# EAGLE design RectifierPartTwo (EAGLE 9.6.2)
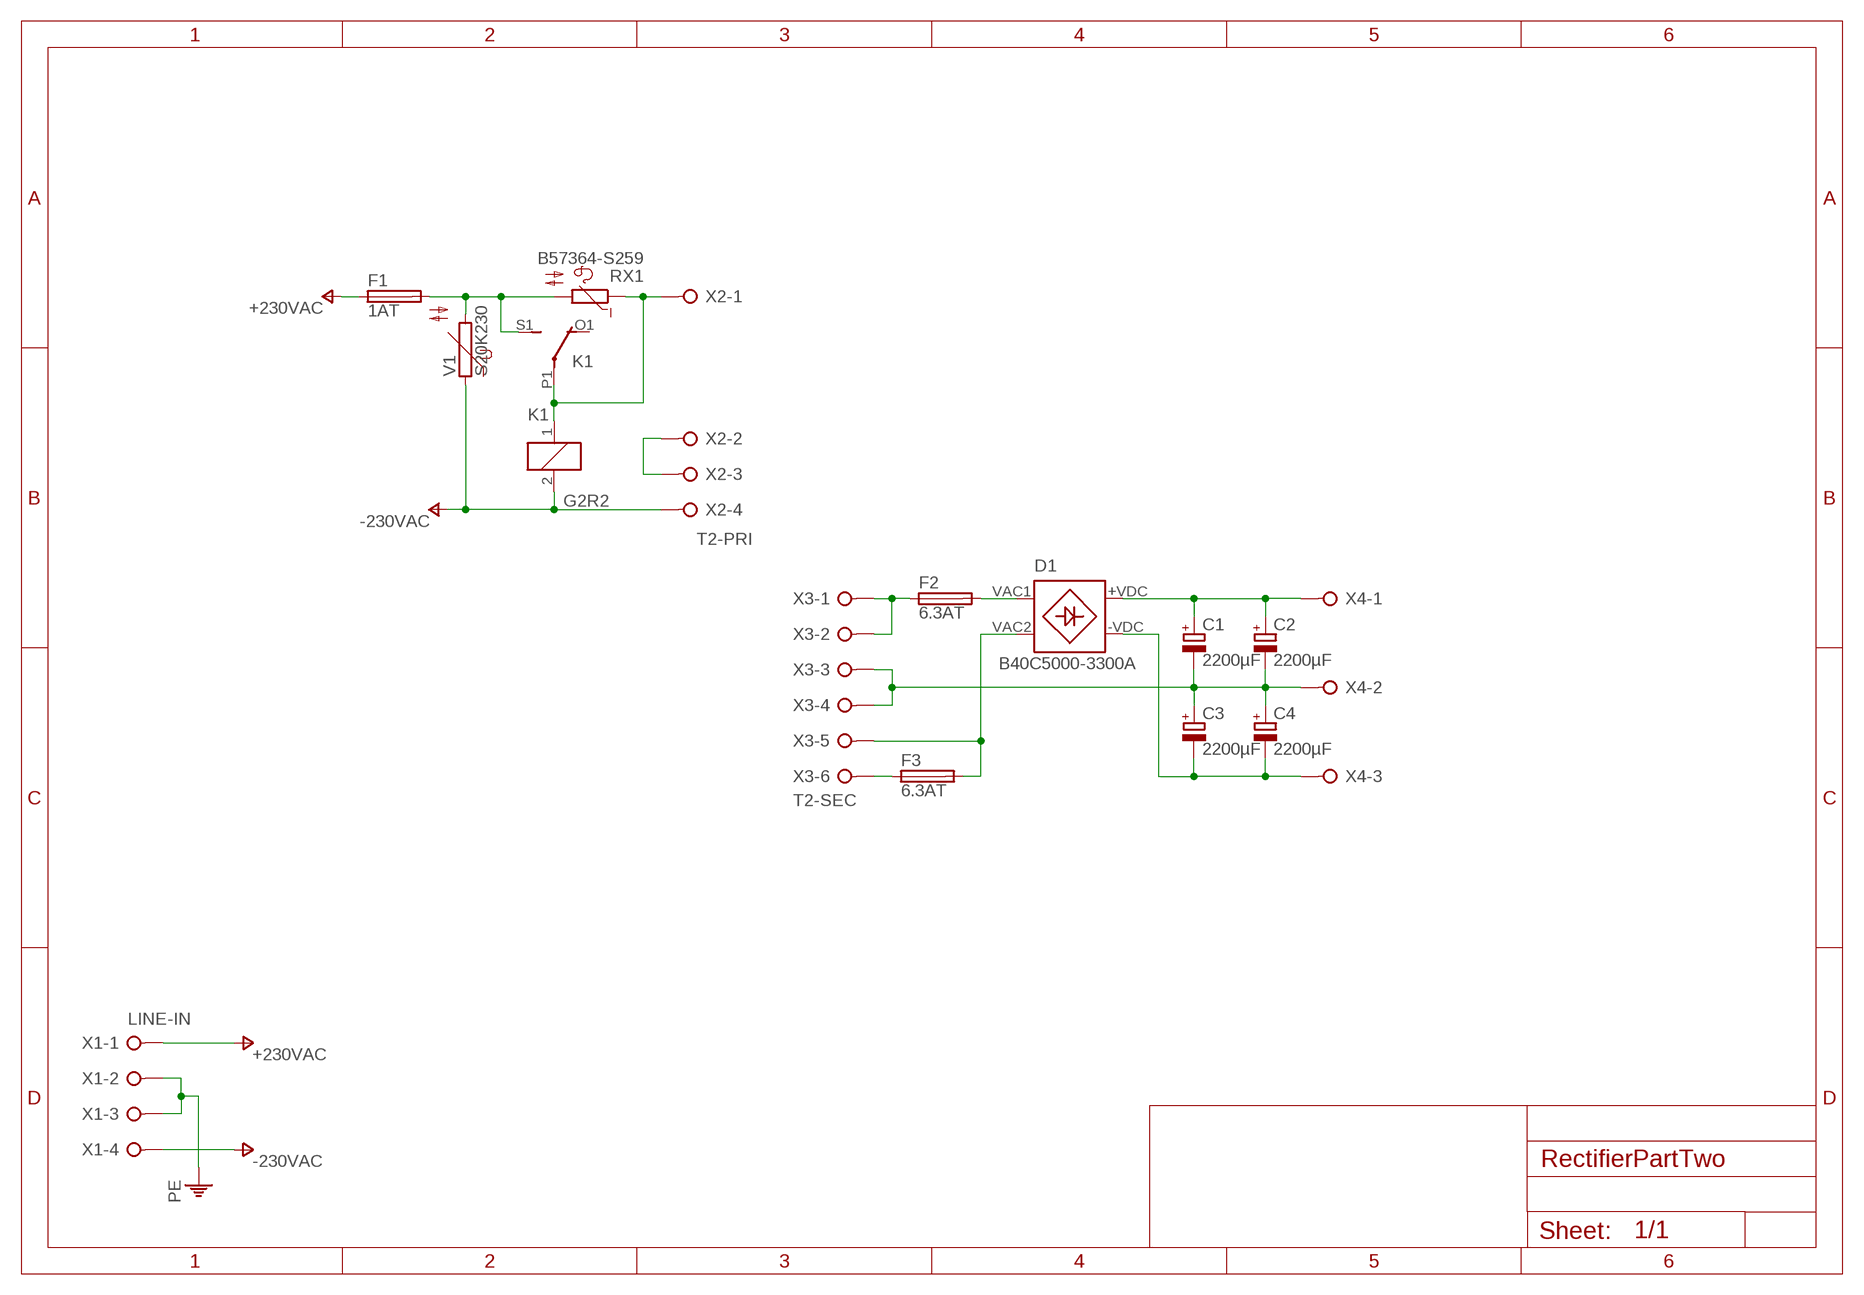
[diagram p0: schematic, sheet 1]

## Parts
C1  2200µF  CPOL-EUE7.5-16  [E7,5-16]
C2  2200µF  CPOL-EUE7.5-16  [E7,5-16]
C3  2200µF  CPOL-EUE7.5-16  [E7,5-16]
C4  2200µF  CPOL-EUE7.5-16  [E7,5-16]
D1  B40C5000-3300A  [B..C]
F1  1AT  SH22,5A  [SH22,5A]
F2  6.3AT  SH22,5A  [SH22,5A]
F3  6.3AT  SH22,5A  [SH22,5A]
K1  G2R2  [G2R2]
RX1  B57364-S259  EPCB57364-S259  [B57364S0]
V1  S20K230  [S20K230]
X1  LINE-IN  W237-04P  [W237-4P]
X2  T2-PRI  W237-04P  [W237-4P]
X3  T2-SEC  W237-06P  [W237-6P]
X4  W237-03P  [W237-133]

## Nets
+230VAC: F1.1 X1.1
-230VAC: K1.2 V1.1 X1.4 X2.4
N$1: D1.VAC2 F3.2 X3.5
N$2: F2.1 X3.1 X3.2
N$3: C3.- C4.- D1.-VDC X4.3
N$4: F3.1 X3.6
N$5: C1.+ C2.+ D1.+VDC X4.1
N$6: C1.- C2.- C3.+ C4.+ X3.3 X3.4 X4.2
N$8: D1.VAC1 F2.2
N$11: F1.2 K1.S1(2:S) RX1.P$2 V1.2
N$23: X2.2 X2.3
N$24: K1.1 K1.P1(2:P) RX1.P$1 X2.1
PE: X1.2 X1.3
Unconnected: K1.O1(2:O) K1.O2(3:O) K1.P2(3:P) K1.S2(3:S)

## Library data of the parts
C1-C4 = rcl:CPOL-EU: POLARIZED CAPACITOR, European symbol; SPICEPREFIX: C
D1 = bb84:B40C5000-3300A: Allgemeines Ausführung: Silizium-Brückengleichrichter Bauform: Standard -WW+ Modell: B40C Elektrische Werte Eingangsspannung: 40VAC Nennstrom: 5A URRM: 80V Maße Breite: 32mm Höhe: 17mm Tiefe: 5,6mm Herstellerangaben Hersteller: DIOTEC Artikelnummer des Herstellers: B40C5000-3300A Verpackungsgewicht: 0.007kg RoHS: konform EAN/GTIN: 9900002169822
F1-F3 = fuse:SH22,5A: FUSE HOLDER grid 22,5mm, isolated cap OGN0031 8201, Schurter (Buerklin); MPN: 0031.7701.11; OC_FARNELL: unknown; OC_NEWARK: 04F1224
K1 = relay:G2R2: RELAY 2 x switch, Omron; MF: OMRON COMPONENTS USA; MPN: G2R-2-DC6; OC_FARNELL: unknown; OC_NEWARK: 89C5317
RX1 = bb84:EPCB57364-S259
V1 = varistor:S20K230: VARISTOR
X1 X2 = con-wago-508:W237-04P: WAGO SREW CLAMP; OC_FARNELL: unknown; OC_NEWARK: unknown
X3 = con-wago-508:W237-06P: WAGO SREW CLAMP; OC_FARNELL: unknown; OC_NEWARK: unknown
X4 = con-wago-508:W237-03P: WAGO SREW CLAMP; OC_FARNELL: unknown; OC_NEWARK: unknown

## Board
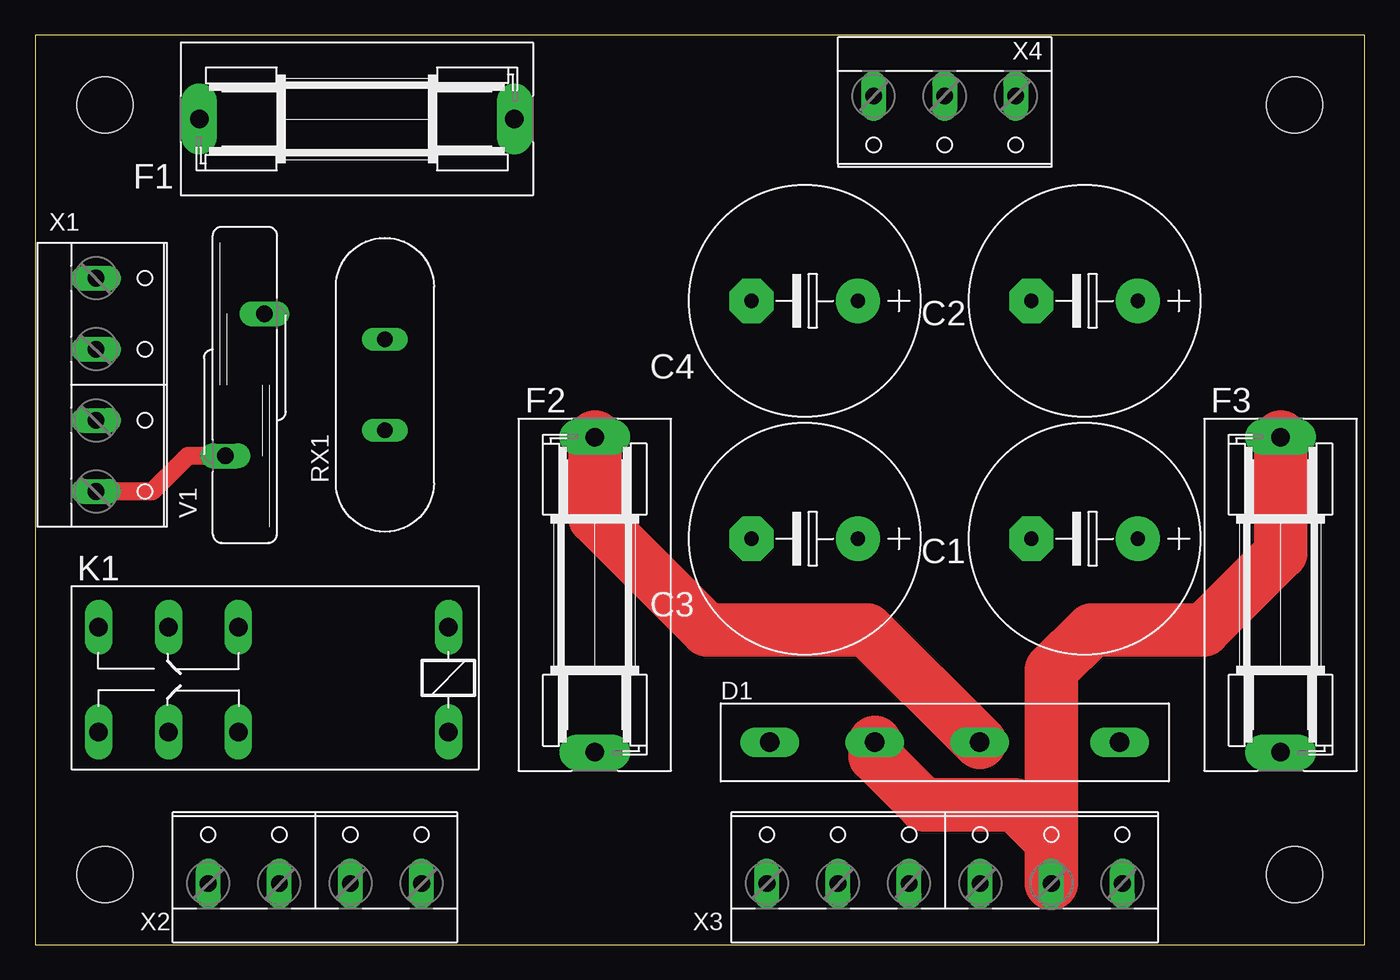
[diagram p1: board, top side]
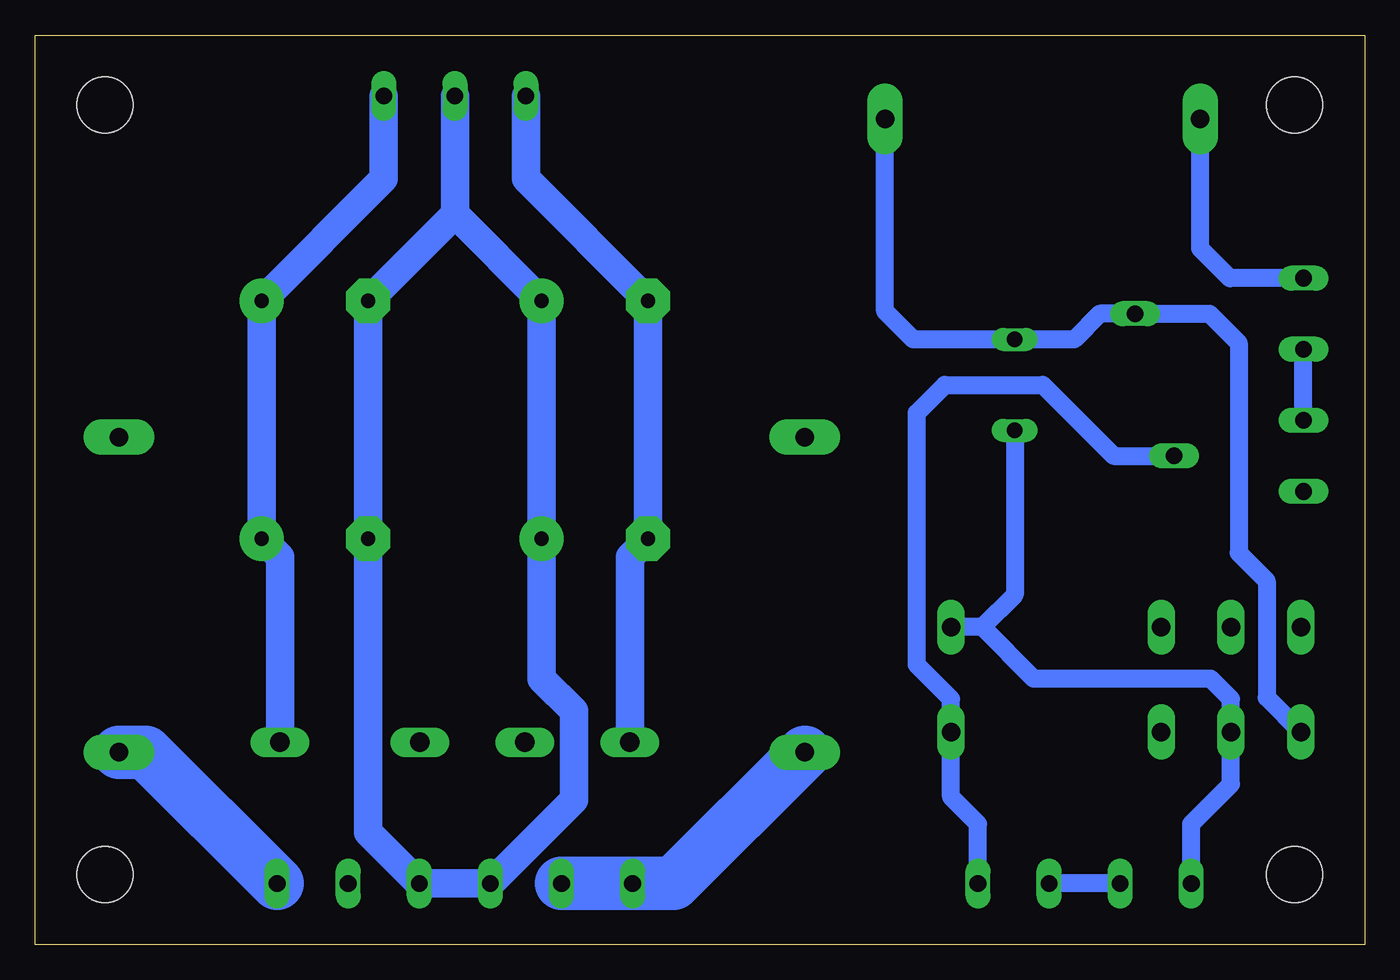
[diagram p2: board, bottom side, seen from below]

Size 95 x 65 mm. Coordinates in mm from the lower left corner, seen from the top.
Outline: 0,0 95,0 95,65 0,65 0,0
Copper layers (1*16): Top 0.035mm / dielectric 1.5mm / Bottom 0.035mm
Design rules "default": minimum track width 6mil, minimum drill 0.35mm, track to track 6mil, track to pad 6mil, pad to pad 6mil, via to via 6mil, smd to smd 6mil, copper to edge 40mil, drill to drill 6mil, minimum pad ring 10mil, minimum via ring 8mil, stop-mask expansion 4mil, vias tented up to drill 0mil, thermal gap 10mil
Holes 4 mm at 5,5 5,60 90,60 90,5

### Footprints (pad centres in the part's own frame; a part is rotated, then mirrored left to right if it is on the bottom)
E7,5-16 = drill 1.016 pad 3.15: + -3.81,0 | drill 1.016 pad 3.15 octagon: - 3.81,0
B..C = drill 1.4 long: +VDC -12.5,0.05; -VDC 12.5,0.05; VAC1 -2.5,0.05; VAC2 5,0.05
SH22,5A = drill 1.321 pad 2.54 long: 1 -11.252,0; 2 11.252,0
G2R2 = drill 1.321 long: 1 -2.54,-3.683; 2 -2.54,3.81; O1 12.471,3.81; O2 12.471,-3.683; P1 17.45,3.81; P2 17.45,-3.683; S1 22.454,3.81; S2 22.454,-3.683
B57364S0 = drill 1.1 long: P$1 -3.25,0; P$2 3.25,0
S20K230 = drill 1.194 long: 1 -1.397,-5.08; 2 1.397,5.08
W237-4P = drill 1.194 long: 1 -7.62,-0.635; 2 -2.54,-0.635; 3 2.54,-0.635; 4 7.62,-0.635
W237-6P = drill 1.194 long: 1 -12.7,-0.635; 2 -7.62,-0.635; 3 -2.54,-0.635; 4 2.54,-0.635; 5 7.62,-0.635; 6 12.7,-0.635
W237-133 = drill 1.194 long: 1 -5.08,-0.635; 2 0,-0.635; 3 5.08,-0.635

### Placement (x,y rotation side)
C1  75,29 180 top
C2  75,46 180 top
C3  55,29 180 top
C4  55,46 180 top
D1  65,14.5 180 top
F1  23,59 0 top
F2  40,25 90 top
F3  89,25 90 top
K1  27,19 180 top
RX1  25,40 90 top
V1  15,40 0 top
X1  5,40 270 top
X2  20,5 0 top
X3  65,5 0 top
X4  65,60 180 top

### Tracks (layer width: path | path; a pad name or v marks a point on that pad's centre or on a via)
+230VAC
  Bottom 1.27: X1.1 9.62,47.62 11.75,49.75 F1.1
-230VAC
  Top 1.27: V1.1 10.92,34.92 8.38,32.38 X1.4
  Bottom 1.27: X2.4 27.62,8.62 29.54,10.54 K1.2 29.54,17.54 32,20 32,38 30,40 23,40 17.92,34.92 V1.1
N$1
  Top 3.81: D1.VAC2 60,13.5 63.5,10 70,10 72.62,7.38 X3.5 72.62,19.62 75.5,22.5 83.5,22.5 89,28 F3.2
N$2
  Bottom 3.81: X3.2 X3.1 49.38,4.37 F2.1
N$3
  Bottom 2.032: X4.3 59.92,54.73 C4.- C3.- 52.5,27.69 D1.-VDC
N$4
  Bottom 3.81: X3.6 87.08,13.75 F3.1
N$5
  Bottom 2.032: X4.1 70.08,54.73 C2.+ C1.+ 77.5,27.69 D1.+VDC
N$6
  Bottom 2.032: 65,52.19 C2.- C1.- 71.19,8.02 X3.4 X3.3 56.5,10.32 56.5,16.69 58.81,19 C3.+ C4.+ 65,52.19 | 65,52.19 X4.2
N$8
  Top 3.81: D1.VAC1 59.45,22.5 48,22.5 40,30.5 F2.2
N$11
  Bottom 1.27: K1.S1 7,17.64 7,26 9,28 9,43 11.08,45.08 V1.2 18.92,45.08 20.75,43.25 RX1.P$2 32.25,43.25 34.25,45.25 F1.2
N$23
  Bottom 1.27: X2.2 X2.3
N$24
  Bottom 1.27: X2.1 12.38,8.62 9.55,11.45 K1.P1 9.55,17.55 11,19 23.63,19 27.32,22.68 | RX1.P$1 25,25 27.32,22.68 | 27.32,22.68 K1.1
PE
  Bottom 1.27: X1.3 X1.2